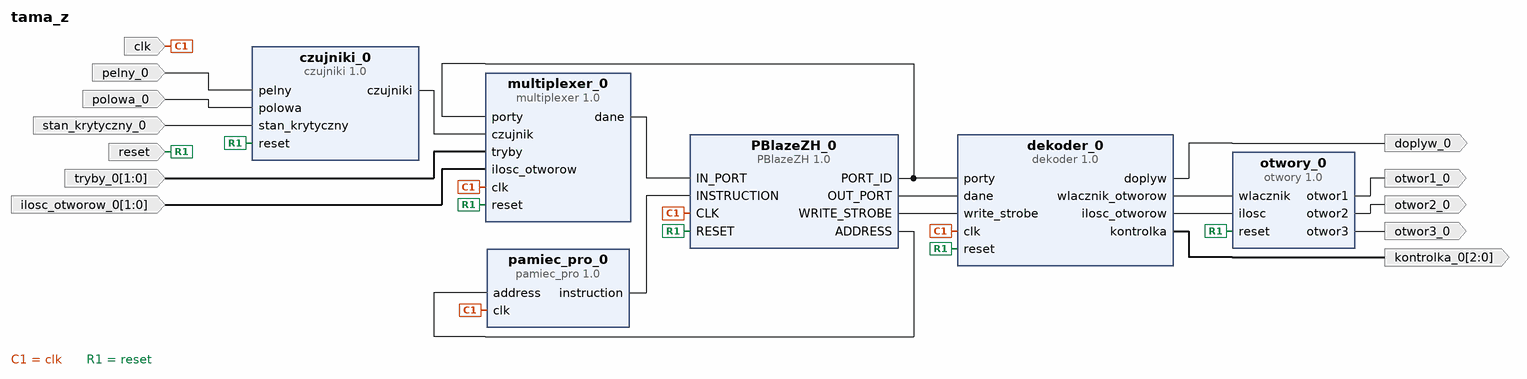
[diagram p0: block diagram of the top level]
# Vivado block design tama_z, xc7z020clg400-3, Vivado 2017.4
create_bd_design tama_z

create_bd_port -dir I pelny_0
create_bd_port -dir I polowa_0
create_bd_port -dir I stan_krytyczny_0
create_bd_port -dir I clk
create_bd_port -dir I -from 1 -to 0 tryby_0
create_bd_port -dir I -from 1 -to 0 ilosc_otworow_0
create_bd_port -dir O doplyw_0
create_bd_port -dir O -from 2 -to 0 kontrolka_0
create_bd_port -dir O otwor1_0
create_bd_port -dir O otwor2_0
create_bd_port -dir O otwor3_0
create_bd_port -dir I reset

create_bd_cell -type ip -vlnv xilinx.com:user:czujniki:1.0 czujniki_0
create_bd_cell -type ip -vlnv xilinx.com:user:PBlazeZH:1.0 PBlazeZH_0
create_bd_cell -type ip -vlnv xilinx.com:user:multiplexer:1.0 multiplexer_0
create_bd_cell -type ip -vlnv xilinx.com:user:dekoder:1.0 dekoder_0
create_bd_cell -type ip -vlnv xilinx.com:user:pamiec_pro:1.0 pamiec_pro_0
create_bd_cell -type ip -vlnv xilinx.com:user:otwory:1.0 otwory_0

# ---- connections ----

connect_bd_net [get_bd_pins czujniki_0/czujniki] [get_bd_pins multiplexer_0/czujnik]
connect_bd_net [get_bd_pins multiplexer_0/dane] [get_bd_pins PBlazeZH_0/IN_PORT]
connect_bd_net [get_bd_pins pamiec_pro_0/instruction] [get_bd_pins PBlazeZH_0/INSTRUCTION]
connect_bd_net [get_bd_ports clk] \
  [get_bd_pins pamiec_pro_0/clk] [get_bd_pins PBlazeZH_0/CLK] [get_bd_pins multiplexer_0/clk] [get_bd_pins dekoder_0/clk]
connect_bd_net [get_bd_ports reset] \
  [get_bd_pins otwory_0/reset] [get_bd_pins dekoder_0/reset] [get_bd_pins PBlazeZH_0/RESET] [get_bd_pins multiplexer_0/reset] \
  [get_bd_pins czujniki_0/reset]
connect_bd_net [get_bd_pins PBlazeZH_0/ADDRESS] [get_bd_pins pamiec_pro_0/address]
connect_bd_net [get_bd_pins PBlazeZH_0/OUT_PORT] [get_bd_pins dekoder_0/dane]
connect_bd_net [get_bd_pins PBlazeZH_0/WRITE_STROBE] [get_bd_pins dekoder_0/write_strobe]
connect_bd_net [get_bd_pins PBlazeZH_0/PORT_ID] [get_bd_pins dekoder_0/porty] [get_bd_pins multiplexer_0/porty]
connect_bd_net [get_bd_pins dekoder_0/wlacznik_otworow] [get_bd_pins otwory_0/wlacznik]
connect_bd_net [get_bd_pins dekoder_0/ilosc_otworow] [get_bd_pins otwory_0/ilosc]
connect_bd_net -net pelny_0_1 [get_bd_ports pelny_0] [get_bd_pins czujniki_0/pelny]
connect_bd_net -net polowa_0_1 [get_bd_ports polowa_0] [get_bd_pins czujniki_0/polowa]
connect_bd_net -net stan_krytyczny_0_1 [get_bd_ports stan_krytyczny_0] [get_bd_pins czujniki_0/stan_krytyczny]
connect_bd_net -net tryby_0_1 [get_bd_ports tryby_0] [get_bd_pins multiplexer_0/tryby]
connect_bd_net -net ilosc_otworow_0_1 [get_bd_ports ilosc_otworow_0] [get_bd_pins multiplexer_0/ilosc_otworow]
connect_bd_net [get_bd_pins dekoder_0/doplyw] [get_bd_ports doplyw_0]
connect_bd_net [get_bd_pins dekoder_0/kontrolka] [get_bd_ports kontrolka_0]
connect_bd_net [get_bd_pins otwory_0/otwor1] [get_bd_ports otwor1_0]
connect_bd_net [get_bd_pins otwory_0/otwor2] [get_bd_ports otwor2_0]
connect_bd_net [get_bd_pins otwory_0/otwor3] [get_bd_ports otwor3_0]

validate_bd_design
save_bd_design
